# Altium schematic sheet 9v_BOOST_CONVERTERS.SchDoc
size A; SheetNumber: 11; SheetTotal: 14
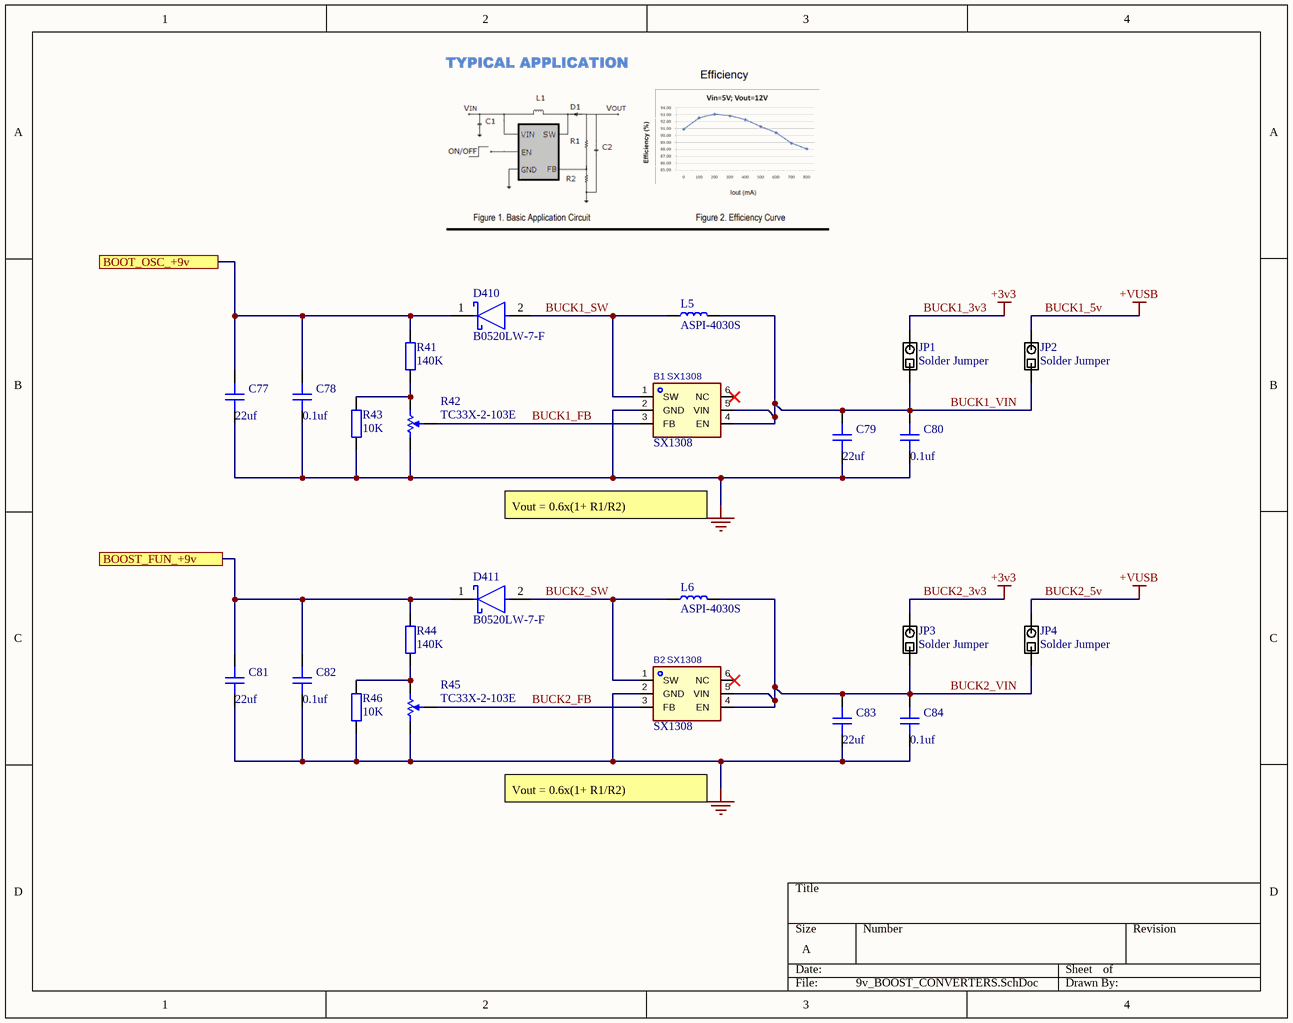
[diagram p0: 9v_BOOST_CONVERTERS.SchDoc]

## Parts
B1  SX1308  [SOT-23-6_L2.9-W1.6-P0.95-LS2.8-BL]
B2  SX1308  [SOT-23-6_L2.9-W1.6-P0.95-LS2.8-BL]
C77  22uf  [CAP_0603]
C78  0.1uf  [CAP_0603]
C79  22uf  [CAP_0603]
C80  0.1uf  [CAP_0603]
C81  22uf  [CAP_0603]
C82  0.1uf  [CAP_0603]
C83  22uf  [CAP_0603]
C84  0.1uf  [CAP_0603]
D410  B0520LW-7-F  [FP-SOD123-MFG]
D411  B0520LW-7-F  [FP-SOD123-MFG]
JP1  Solder Jumper  [SolderJumper_Single]
JP2  Solder Jumper  [SolderJumper_Single]
JP3  Solder Jumper  [SolderJumper_Single]
JP4  Solder Jumper  [SolderJumper_Single]
L5  ASPI-4030S  [ASPI-4030S]
L6  ASPI-4030S  [ASPI-4030S]
R41  140K  [RES_0603]
R42  TC33X-2-103E  [BOUR-TC33X-2_V]
R43  10K  [RES_0603]
R44  140K  [RES_0603]
R45  TC33X-2-103E  [BOUR-TC33X-2_V]
R46  10K  [RES_0603]

## Ports
BOOST_FUN_+9v, BOOT_OSC_+9v

## Nets
BUCK1_3v3: JP1.2 JP3.2  [also labelled +3v3, BUCK2_3v3]
BUCK1_5v: JP2.2 JP4.2  [also labelled +VUSB, BUCK2_5v]
GND: B1.2(GND) B2.2(GND) C77.1 C78.1 C79.1 C80.1 C81.1 C82.1 C83.1 C84.1 R42.1 R43.1 R45.1 R46.1
BOOST_FUN_+9v: C81.2 C82.2 D411.1(C) R44.2 ; port BOOST_FUN_+9v
BOOT_OSC_+9v: C77.2 C78.2 D410.1(C) R41.2 ; port BOOT_OSC_+9v
BUCK1_FB: B1.3(FB) R42.2
BUCK1_SW: B1.1(SW) D410.2(A) L5.1
BUCK1_VIN: B1.4(EN) B1.5(VIN) C79.2 C80.2 JP1.1 JP2.1 L5.2
BUCK2_FB: B2.3(FB) R45.2
BUCK2_SW: B2.1(SW) D411.2(A) L6.1
BUCK2_VIN: B2.4(EN) B2.5(VIN) C83.2 C84.2 JP3.1 JP4.1 L6.2
NetR41_1: R41.1 R42.3 R43.2
NetR44_1: R44.1 R45.3 R46.2

Not connected (* = marked no-connect by the designer): B1 6(NC)*; B2 6(NC)*

## Notes on the sheet
- Vout = 0.6x(1+ R1/R2)

## Library data of the parts
C77-C84 = CAP_0603: Capacitor SMD 0603; Manufacturer: *; Manufacturer Part Number: *; Distributor Link: *; LCSC: *; Rating: *; Dielectric: *
D410 D411 = CMP-12790-000026-1: DIODE SCHOTTKY 20V 500MA SOD123; Manufacturer: Diodes Inc.; Max Junction Temp: +125°C; Value: 170pF; Max Surge Forward Current: 5.5A; Forward Current: 0.5A; Standoff Height: 0mm; Peak Reverse Current: 250uA; Octopart: https://octopart.com/b0520lw-7-f-diodes+inc.-325707; Mouser Description: Schottky Diodes & Rectifiers 20V 410mW; ComponentLink2Description: Datasheet; Ipc Land Pattern Name: SOD365155X123-2; Device Class L1: Discrete Semiconductors; Category: Diode; ComponentLink2URL: https://www.diodes.com/assets/Datasheets/ds30051.pdf; Footprint Url: https://www.diodes.com/assets/Package-Files/SOD123.pdf; Package: SOD123; Device Class L3: Schottky Diodes; Digikey Description: DIODE SCHOTTKY 20V 500MA SOD123; Temperature Range Low: -65°C; RoHS: TRUE; Max Repetitive Reverse Voltage: 20V; Lead Free: Yes; Temperature: -65°C to +125°C; Reverse Voltage: 20V; Temperature Range High: +125°C; Capacitance: 170pF; Device Class L2: Diodes; Automotive: No; Height: 1.45mm; Manufacturer Part Number: B0520LW-7-F
JP1-JP4 = SolderJumper_Single: Solder Jumper Single 0.5mm Pitch
L5 L6 = ASPI-4030S: Power Inductor SMD ASPI-4030S Series; Manufacturer: ABRACON; Manufacturer Part Number: ASPI-4030S*; Distirbutor Link: *
R41 R43 R44 R46 = RES_0603: Resistor SMD 0603; Manufacturer: *; Manufacturer Part Number: *; Distributor Link: *; LCSC: *
R42 R45 = CMP-2100-03695-1: Trimming Potentiometer, 10000 Ohm, -40 to 100 degC, 3-Pin SMD, RoHS, Tape and Reel; Manufacturer: Bourns; Tolerance: 25%; Max Power Dissipation: 100mW; Number of Turns: 1; Resistance: 10KOhm; Temperature Coefficient: 250ppm/degreesC; Voltage Rating (DC): 50V; Datasheet URL: http://www.bourns.com/docs/Product-Datasheets/TC33.pdf; Composition: Potentiometer; Package Description: 3-Pin Surface Mount Device, Body 3.8 x 3.6 mm; Weight: 29.4mg; Power Rating: 100mW; Termination: FootPrint; Manufacturer URL: http://www.bourns.com/; Width: 0.118inch; Height: 0.047inch; Military Standard: Not; Radiation Hardening: No; Colour: Silver; Case/Package: SMD/SMT; Depth: 3.8mm; Min Operating Temperature: -40degC; Lead Free: LeadFree; Datasheet Version: 42583.0; REACH SVHC: NoSVHC; Length: 3mm; RoHSCompliant: true; Contact Plating: Silver; Taper: Linear; Packaging: TapeandReel; Mount: SurfaceMount; Max Operating Temperature: 100degC; Package Reference: TC33X-2; Package Quantity: 2500
B1 B2 = SX1308: Footprint: easyeda2kicad:SOT-23-6_L2.9-W1.6-P0.95-LS2.8-BL; Datasheet: https://lcsc.com/product-detail/DC-DC-Converters_SX1308_C78162.html; LCSC Part: C78162; Value: SX1308